# EAGLE design core_ft232 (EAGLE 6.4)
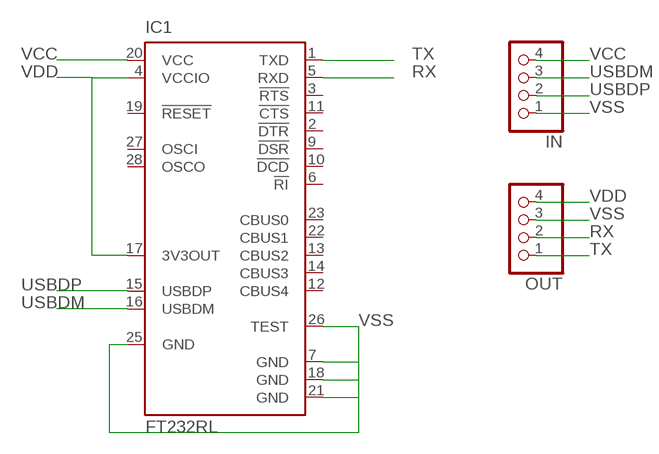
[diagram p0: schematic, sheet 1]

## Parts
IC1  FT232RL  [SSOP28]
IN  PINHD-1X4  [1X04]
OUT  PINHD-1X4  [1X04]

## Nets
RX: IC1.5(RXD) OUT.2
TX: IC1.1(TXD) OUT.1
USBDM: IC1.16(USBDM) IN.3
USBDP: IC1.15(USBDP) IN.2
VCC: IC1.20(VCC) IN.4
VDD: IC1.4(VCCIO) IC1.17(3V3OUT) OUT.4
VSS: IC1.7(GND) IC1.18(GND) IC1.21(GND) IC1.25(GND) IC1.26(TEST) IN.1 OUT.3
Unconnected: IC1.2(!DTR) IC1.3(!RTS) IC1.6(!RI) IC1.9(!DSR) IC1.10(!DCD) IC1.11(!CTS) IC1.12(CBUS4) IC1.13(CBUS2) IC1.14(CBUS3) IC1.19(!RESET) IC1.22(CBUS1) IC1.23(CBUS0) IC1.27(OSCI) IC1.28(OSCO)

## Library data of the parts
IC1 = ftdichip:FT232R: Source: http://www.ftdichip.com/Documents/DataSheets/DS_FT232R_v104.pdf; MPN: FT232RL; OC_FARNELL: 1146032; OC_NEWARK: 91K9918
IN OUT = pinhead:PINHD-1X4: PIN HEADER

## Board
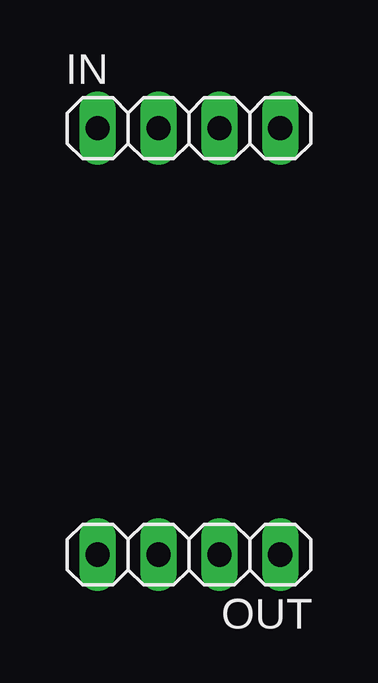
[diagram p1: board, top side]
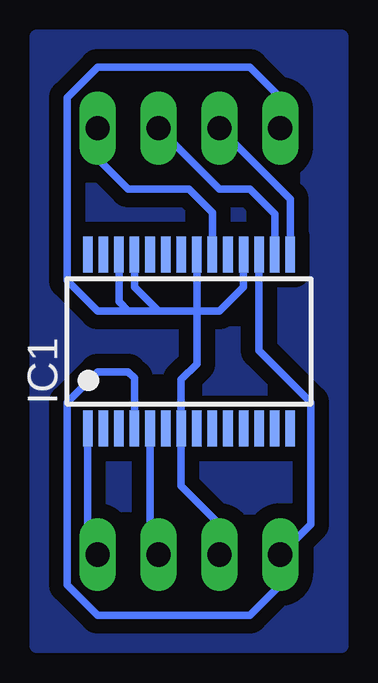
[diagram p2: board, bottom side, seen from below]

No outline drawn. Coordinates in mm, seen from the top.
Copper layers (1*16): Top 0.035mm / dielectric 1.5mm / Bottom 0.035mm
Design rules "default": minimum track width 10mil, minimum drill 24mil, track to track 8mil, track to pad 8mil, pad to pad 8mil, via to via 8mil, smd to smd 8mil, copper to edge 40mil, drill to drill 8mil, minimum pad ring 10mil, minimum via ring 8mil, stop-mask expansion 4mil, vias tented up to drill 0mil, thermal gap 10mil

### Footprints (pad centres in the part's own frame; a part is rotated, then mirrored left to right if it is on the bottom)
SSOP28 = smd 0.4 x 1.5: 1 -4.225,-3.625; 2 -3.575,-3.625; 3 -2.925,-3.625; 4 -2.275,-3.625; 5 -1.625,-3.625; 6 -0.975,-3.625; 7 -0.325,-3.625; 8 0.325,-3.625; 9 0.975,-3.625; 10 1.625,-3.625; 11 2.275,-3.625; 12 2.925,-3.625; 13 3.575,-3.625; 14 4.225,-3.625; 15 4.225,3.625; 16 3.575,3.625; 17 2.925,3.625; 18 2.275,3.625; 19 1.625,3.625; 20 0.975,3.625; 21 0.325,3.625; 22 -0.325,3.625; 23 -0.975,3.625; 24 -1.625,3.625; 25 -2.275,3.625; 26 -2.925,3.625; 27 -3.575,3.625; 28 -4.225,3.625
1X04 = drill 1.016 long: 1 -3.81,0; 2 -1.27,0; 3 1.27,0; 4 3.81,0

### Placement (x,y rotation side)
IC1  49.53,38.1 0 bottom
IN  49.53,46.99 0 top
OUT  49.53,29.21 180 top

### Tracks (layer width: path | path; a pad name or v marks a point on that pad's centre or on a via)
N$1
  pour Bottom (isolate 0.61): 43.18,50.8 55.88,50.8 55.88,25.4 43.18,25.4
RX
  Bottom 0.305: IC1.5 51.16,29.57 OUT.2
TX
  Bottom 0.305: IC1.1 53.76,29.62 OUT.1
USBDM
  Bottom 0.305: IC1.16 45.95,43.41 46.99,44.45 48.26,44.45 IN.3
USBDP
  Bottom 0.305: IC1.15 45.3,44.03 IN.2
VCC
  Bottom 0.305: IC1.20 48.55,43.48 49.53,44.45 52.07,44.45 53.34,45.72 IN.4
VDD
  Bottom 0.305: IC1.4 51.8,36.56 52.07,36.83 53.34,36.83 54.61,35.56 54.61,27.94 53.34,26.67 46.99,26.67 45.72,27.94 OUT.4 44.45,30.48 44.45,35.56 46.6,37.72 IC1.17
VSS
  Bottom 0.305: OUT.3 48.26,30.48 49.85,32.08 IC1.7 49.85,36.51 49.2,37.16 49.2,39.37 | IC1.21 49.2,39.37 | IC1.25 51.8,40.38 50.8,39.37 | 50.8,39.37 49.2,39.37 | IC1.26 52.45,39.76 52.07,39.37 | 52.07,39.37 50.8,39.37 | IC1.18 47.26,40.38 48.26,39.37 49.2,39.37 | IN.1 45.72,48.26 46.99,49.53 53.34,49.53 54.61,48.26 54.61,40.64 53.34,39.37 52.07,39.37